# EAGLE design osh-2l-cpwg-via75-v2 (EAGLE 9.4.1)
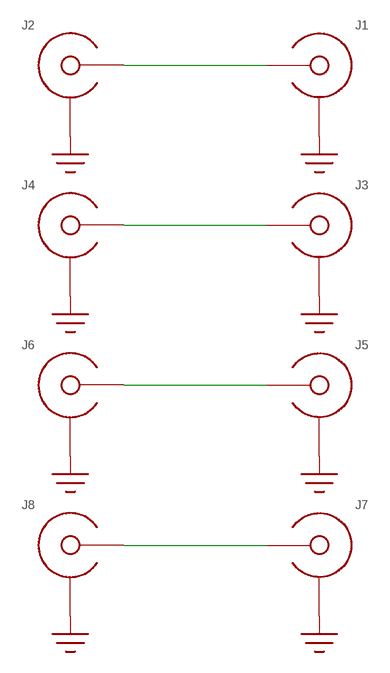
[diagram p0: schematic, sheet 1]

## Parts
J1  SMA-EDGE-LAUNCH4020_TAPER  [SMA_EDGE_LAUNCH_2L_4020_TAPER]
J2  SMA-EDGE-LAUNCH4020_TAPER  [SMA_EDGE_LAUNCH_2L_4020_TAPER]
J3  SMA-EDGE-LAUNCH4020_TAPER  [SMA_EDGE_LAUNCH_2L_4020_TAPER]
J4  SMA-EDGE-LAUNCH4020_TAPER  [SMA_EDGE_LAUNCH_2L_4020_TAPER]
J5  SMA-EDGE-LAUNCH4020_TAPER  [SMA_EDGE_LAUNCH_2L_4020_TAPER]
J6  SMA-EDGE-LAUNCH4020_TAPER  [SMA_EDGE_LAUNCH_2L_4020_TAPER]
J7  SMA-EDGE-LAUNCH4020_TAPER  [SMA_EDGE_LAUNCH_2L_4020_TAPER]
J8  SMA-EDGE-LAUNCH4020_TAPER  [SMA_EDGE_LAUNCH_2L_4020_TAPER]

## Nets
GND: J1.BOTTOM_GND(SHIELD) J1.GND@1(SHIELD) J1.GND@2(SHIELD) J1.GND@3(SHIELD) J1.GND@4(SHIELD) J1.GND@5(SHIELD) J1.GND@6(SHIELD) J1.GND@7(SHIELD) J1.GND@8(SHIELD) J1.GND@14(SHIELD) J1.GND@15(SHIELD) J1.GND@16(SHIELD) J1.GND@17(SHIELD) J1.GND_PAD1(SHIELD) J1.GND_PAD2(SHIELD) J1.P$1(SHIELD) J1.P$2(SHIELD) J2.BOTTOM_GND(SHIELD) J2.GND@1(SHIELD) J2.GND@2(SHIELD) J2.GND@3(SHIELD) J2.GND@4(SHIELD) J2.GND@5(SHIELD) J2.GND@6(SHIELD) J2.GND@7(SHIELD) J2.GND@8(SHIELD) J2.GND@14(SHIELD) J2.GND@15(SHIELD) J2.GND@16(SHIELD) J2.GND@17(SHIELD) J2.GND_PAD1(SHIELD) J2.GND_PAD2(SHIELD) J2.P$1(SHIELD) J2.P$2(SHIELD) J3.BOTTOM_GND(SHIELD) J3.GND@1(SHIELD) J3.GND@2(SHIELD) J3.GND@3(SHIELD) J3.GND@4(SHIELD) J3.GND@5(SHIELD) J3.GND@6(SHIELD) J3.GND@7(SHIELD) J3.GND@8(SHIELD) J3.GND@14(SHIELD) J3.GND@15(SHIELD) J3.GND@16(SHIELD) J3.GND@17(SHIELD) J3.GND_PAD1(SHIELD) J3.GND_PAD2(SHIELD) J3.P$1(SHIELD) J3.P$2(SHIELD) J4.BOTTOM_GND(SHIELD) J4.GND@1(SHIELD) J4.GND@2(SHIELD) J4.GND@3(SHIELD) J4.GND@4(SHIELD) J4.GND@5(SHIELD) J4.GND@6(SHIELD) J4.GND@7(SHIELD) J4.GND@8(SHIELD) J4.GND@14(SHIELD) J4.GND@15(SHIELD) J4.GND@16(SHIELD) J4.GND@17(SHIELD) J4.GND_PAD1(SHIELD) J4.GND_PAD2(SHIELD) J4.P$1(SHIELD) J4.P$2(SHIELD) J5.BOTTOM_GND(SHIELD) J5.GND@1(SHIELD) J5.GND@2(SHIELD) J5.GND@3(SHIELD) J5.GND@4(SHIELD) J5.GND@5(SHIELD) J5.GND@6(SHIELD) J5.GND@7(SHIELD) J5.GND@8(SHIELD) J5.GND@14(SHIELD) J5.GND@15(SHIELD) J5.GND@16(SHIELD) J5.GND@17(SHIELD) J5.GND_PAD1(SHIELD) J5.GND_PAD2(SHIELD) J5.P$1(SHIELD) J5.P$2(SHIELD) J6.BOTTOM_GND(SHIELD) J6.GND@1(SHIELD) J6.GND@2(SHIELD) J6.GND@3(SHIELD) J6.GND@4(SHIELD) J6.GND@5(SHIELD) J6.GND@6(SHIELD) J6.GND@7(SHIELD) J6.GND@8(SHIELD) J6.GND@14(SHIELD) J6.GND@15(SHIELD) J6.GND@16(SHIELD) J6.GND@17(SHIELD) J6.GND_PAD1(SHIELD) J6.GND_PAD2(SHIELD) J6.P$1(SHIELD) J6.P$2(SHIELD) J7.BOTTOM_GND(SHIELD) J7.GND@1(SHIELD) J7.GND@2(SHIELD) J7.GND@3(SHIELD) J7.GND@4(SHIELD) J7.GND@5(SHIELD) J7.GND@6(SHIELD) J7.GND@7(SHIELD) J7.GND@8(SHIELD) J7.GND@14(SHIELD) J7.GND@15(SHIELD) J7.GND@16(SHIELD) J7.GND@17(SHIELD) J7.GND_PAD1(SHIELD) J7.GND_PAD2(SHIELD) J7.P$1(SHIELD) J7.P$2(SHIELD) J8.BOTTOM_GND(SHIELD) J8.GND@1(SHIELD) J8.GND@2(SHIELD) J8.GND@3(SHIELD) J8.GND@4(SHIELD) J8.GND@5(SHIELD) J8.GND@6(SHIELD) J8.GND@7(SHIELD) J8.GND@8(SHIELD) J8.GND@14(SHIELD) J8.GND@15(SHIELD) J8.GND@16(SHIELD) J8.GND@17(SHIELD) J8.GND_PAD1(SHIELD) J8.GND_PAD2(SHIELD) J8.P$1(SHIELD) J8.P$2(SHIELD)
N$1 [30-6]: J1.CENTER@1(CENTER) J2.CENTER@1(CENTER)
N$2 [28-6]: J3.CENTER@1(CENTER) J4.CENTER@1(CENTER)
N$3 [26-6]: J5.CENTER@1(CENTER) J6.CENTER@1(CENTER)
N$4 [24-6]: J7.CENTER@1(CENTER) J8.CENTER@1(CENTER)

## Library data of the parts
J1 J3 J5 J7 = sma_footprint_2l:SMA-EDGE-LAUNCH
J2 J4 J6 J8 = yapo:SMA-EDGE-LAUNCH

## Net classes
1 26-6: width 0.66 mm, clearance 0.152 mm
2 27-6: width 0.686 mm, clearance 0.152 mm
3 28-6: width 0.711 mm, clearance 0.152 mm
4 29-6: width 0.737 mm, clearance 0.152 mm
5 30-6: width 0.762 mm, clearance 0.152 mm
6 32-6: width 0.813 mm, clearance 0.152 mm
7 24-6: width 0.61 mm, clearance 0.152 mm

## Board
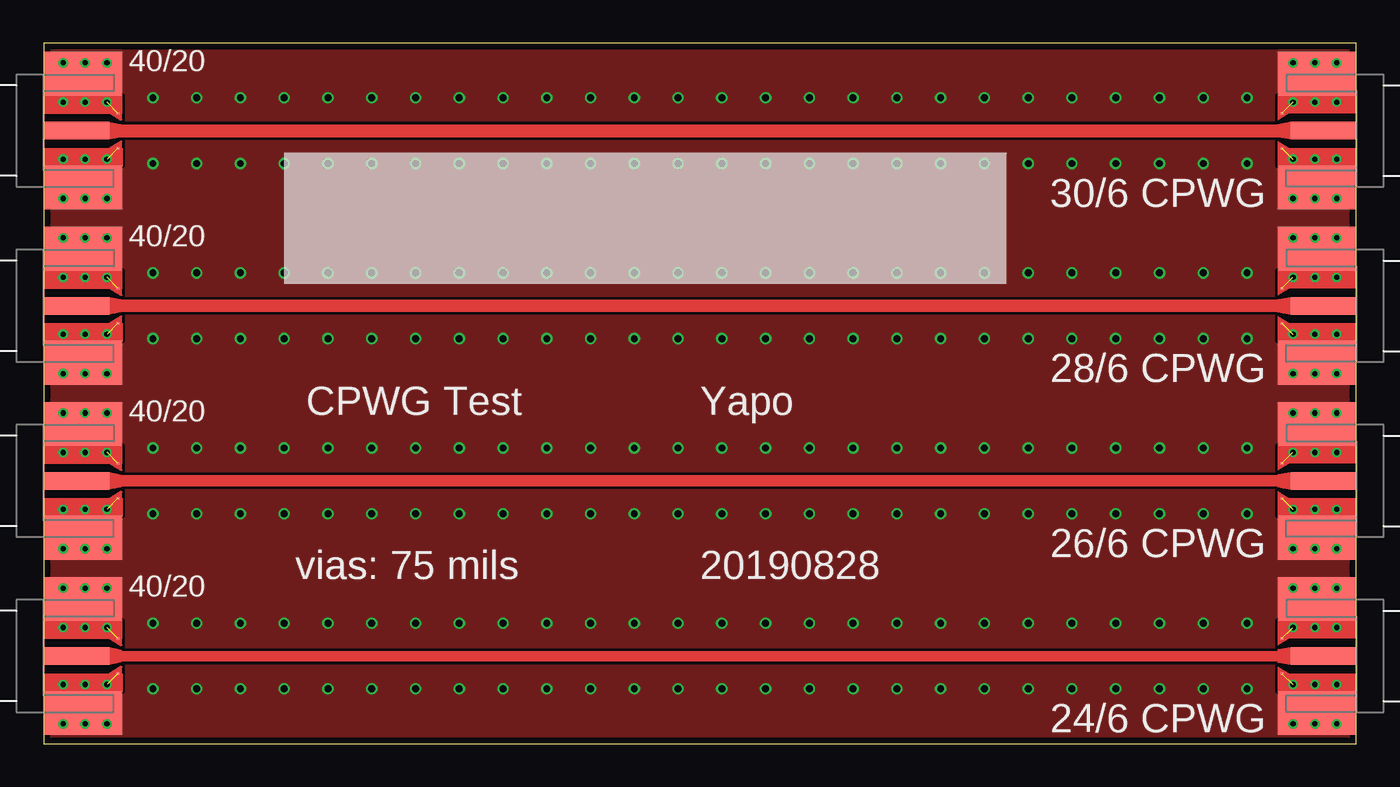
[diagram p1: board, top side]
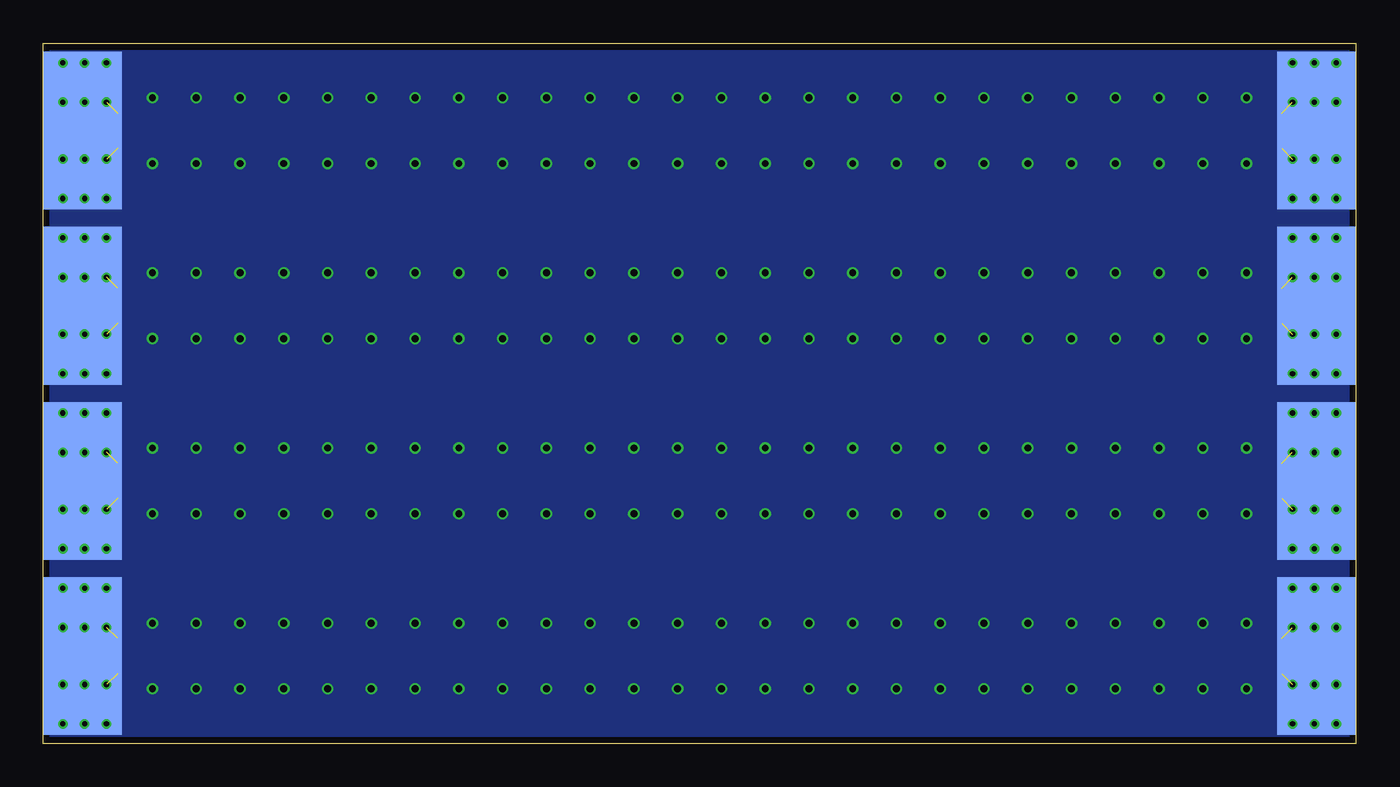
[diagram p2: board, bottom side, seen from below]

Size 76.2 x 40.64 mm. Coordinates in mm from the lower left corner, seen from the top.
Outline: 0,0 76.2,0 76.2,40.64 0,40.64 0,0
Copper layers (1*16): Top 0.035559375mm / dielectric 1.6mm / Bottom 0.035559375mm
Design rules "oshpark-2layer *": minimum track width 6mil, minimum drill 10mil, track to track 6mil, track to pad 6mil, pad to pad 6mil, via to via 6mil, smd to smd 6mil, copper to edge 15mil, drill to drill 6mil, minimum pad ring 5mil, minimum via ring 5mil, stop-mask expansion 2.5mil, vias tented up to drill 20mil, thermal gap 10mil

### Footprints (pad centres in the part's own frame; a part is rotated, then mirrored left to right if it is on the bottom)
SMA_EDGE_LAUNCH_2L_4020_TAPER = smd 4.572 x 9.144 bottom: BOTTOM_GND 2.286,0 | smd 3.81 x 1.016: CENTER@1 1.905,0 | drill 0.3: GND@1 1.143,3.937; GND@2 3.683,3.937; GND@3 1.143,1.651; GND@4 3.683,1.651; GND@5 1.143,-1.651; GND@6 3.683,-1.651; GND@7 1.143,-3.937; GND@8 3.683,-3.937; GND@14 2.413,3.937; GND@15 2.413,-3.937; GND@16 2.413,-1.651; GND@17 2.413,1.651 | smd 4.572 x 2.54: GND_PAD1 2.286,3.302; GND_PAD2 2.286,-3.302 | smd 0.127 x 0.127: P$1 4.318,1.016; P$2 4.318,-1.016

### Placement (x,y rotation side)
J1  0,35.56 0 top
J2  76.2,35.56 180 top
J3  0,25.4 0 top
J4  76.2,25.4 180 top
J5  0,15.24 0 top
J6  76.2,15.24 180 top
J7  0,5.08 0 top
J8  76.2,5.08 180 top

### Tracks (layer width: path | path; a pad name or v marks a point on that pad's centre or on a via)
GND  (via drill 0.4)  (16 unrouted)
  other vias: 6.35,37.47 8.89,37.47 11.43,37.47 13.97,37.47 16.51,37.47 19.05,37.47 21.59,37.47 24.13,37.47 26.67,37.47 29.21,37.47 31.75,37.47 34.29,37.47 36.83,37.47 39.37,37.47 41.91,37.47 44.45,37.47 46.99,37.47 49.53,37.47 52.07,37.47 54.61,37.47 57.15,37.47 59.69,37.47 62.23,37.47 64.77,37.47 67.31,37.47 69.85,37.47 6.35,33.66 8.89,33.66 11.43,33.66 13.97,33.66 16.51,33.66 19.05,33.66 21.59,33.66 24.13,33.66 26.67,33.66 29.21,33.66 31.75,33.66 34.29,33.66 36.83,33.66 39.37,33.66 41.91,33.66 44.45,33.66 46.99,33.66 49.53,33.66 52.07,33.66 54.61,33.66 57.15,33.66 59.69,33.66 62.23,33.66 64.77,33.66 67.31,33.66 69.85,33.66 6.35,27.3 8.89,27.3 11.43,27.3 13.97,27.3 16.51,27.3 19.05,27.3 21.59,27.3 24.13,27.3 26.67,27.3 29.21,27.3 31.75,27.3 34.29,27.3 36.83,27.3 39.37,27.3 41.91,27.3 44.45,27.3 46.99,27.3 49.53,27.3 52.07,27.3 54.61,27.3 57.15,27.3 59.69,27.3 62.23,27.3 64.77,27.3 67.31,27.3 69.85,27.3 6.35,23.5 8.89,23.5 11.43,23.5 13.97,23.5 16.51,23.5 19.05,23.5 21.59,23.5 24.13,23.5 26.67,23.5 29.21,23.5 31.75,23.5 34.29,23.5 36.83,23.5 39.37,23.5 41.91,23.5 44.45,23.5 46.99,23.5 49.53,23.5 52.07,23.5 54.61,23.5 57.15,23.5 59.69,23.5 62.23,23.5 64.77,23.5 67.31,23.5 69.85,23.5 6.35,17.14 8.89,17.14 11.43,17.14 13.97,17.14 16.51,17.14 19.05,17.14 21.59,17.14 24.13,17.14 26.67,17.14 29.21,17.14 31.75,17.14 34.29,17.14 36.83,17.14 39.37,17.14 41.91,17.14 44.45,17.14 46.99,17.14 49.53,17.14 52.07,17.14 54.61,17.14 57.15,17.14 59.69,17.14 62.23,17.14 64.77,17.14 67.31,17.14 69.85,17.14 6.35,13.34 8.89,13.34 11.43,13.34 13.97,13.34 16.51,13.34 19.05,13.34 21.59,13.34 24.13,13.34 26.67,13.34 29.21,13.34 31.75,13.34 34.29,13.34 36.83,13.34 39.37,13.34 41.91,13.34 44.45,13.34 46.99,13.34 49.53,13.34 52.07,13.34 54.61,13.34 57.15,13.34 59.69,13.34 62.23,13.34 64.77,13.34 67.31,13.34 69.85,13.34 6.35,6.99 8.89,6.99 11.43,6.99 13.97,6.99 16.51,6.99 19.05,6.99 21.59,6.99 24.13,6.99 26.67,6.99 29.21,6.99 31.75,6.99 34.29,6.99 36.83,6.99 39.37,6.99 41.91,6.99 44.45,6.99 46.99,6.99 49.53,6.99 52.07,6.99 54.61,6.99 57.15,6.99 59.69,6.99 62.23,6.99 64.77,6.99 67.31,6.99 69.85,6.99 6.35,3.17 8.89,3.17 11.43,3.17 13.97,3.17 16.51,3.17 19.05,3.17 21.59,3.17 24.13,3.17 26.67,3.17 29.21,3.17 31.75,3.17 34.29,3.17 36.83,3.17 39.37,3.17 41.91,3.17 44.45,3.17 46.99,3.17 49.53,3.17 52.07,3.17 54.61,3.17 57.15,3.17 59.69,3.17 62.23,3.17 64.77,3.17 67.31,3.17 69.85,3.17
  pour Top (no thermals): 0,0 0,40.64 76.2,40.64 76.2,0
  pour Bottom: 0,0 0,40.64 76.2,40.64 76.2,0
N$1
  Top 0.762: J1.CENTER@1 J2.CENTER@1
N$2
  Top 0.711: J3.CENTER@1 J4.CENTER@1
N$3
  Top 0.66: J5.CENTER@1 J6.CENTER@1
N$4
  Top 0.61: J7.CENTER@1 J8.CENTER@1

### Text on the board
tPlace: 30/6 CPWG | 28/6 CPWG | CPWG Test | Yapo | 26/6 CPWG | vias: 75 mils | 20190828 | 24/6 CPWG